# EasyEDA Pro project chaser.eprj

# Schematic Schematic1
Board Name: Board1; Create Date: 2025-12-24; Page Name: P1; Project Name: chaser; Schematic Name: Schematic1; Update Date: 2025-12-25; Company: EasyEDA.com; Page Size: A4; Version: V1.0
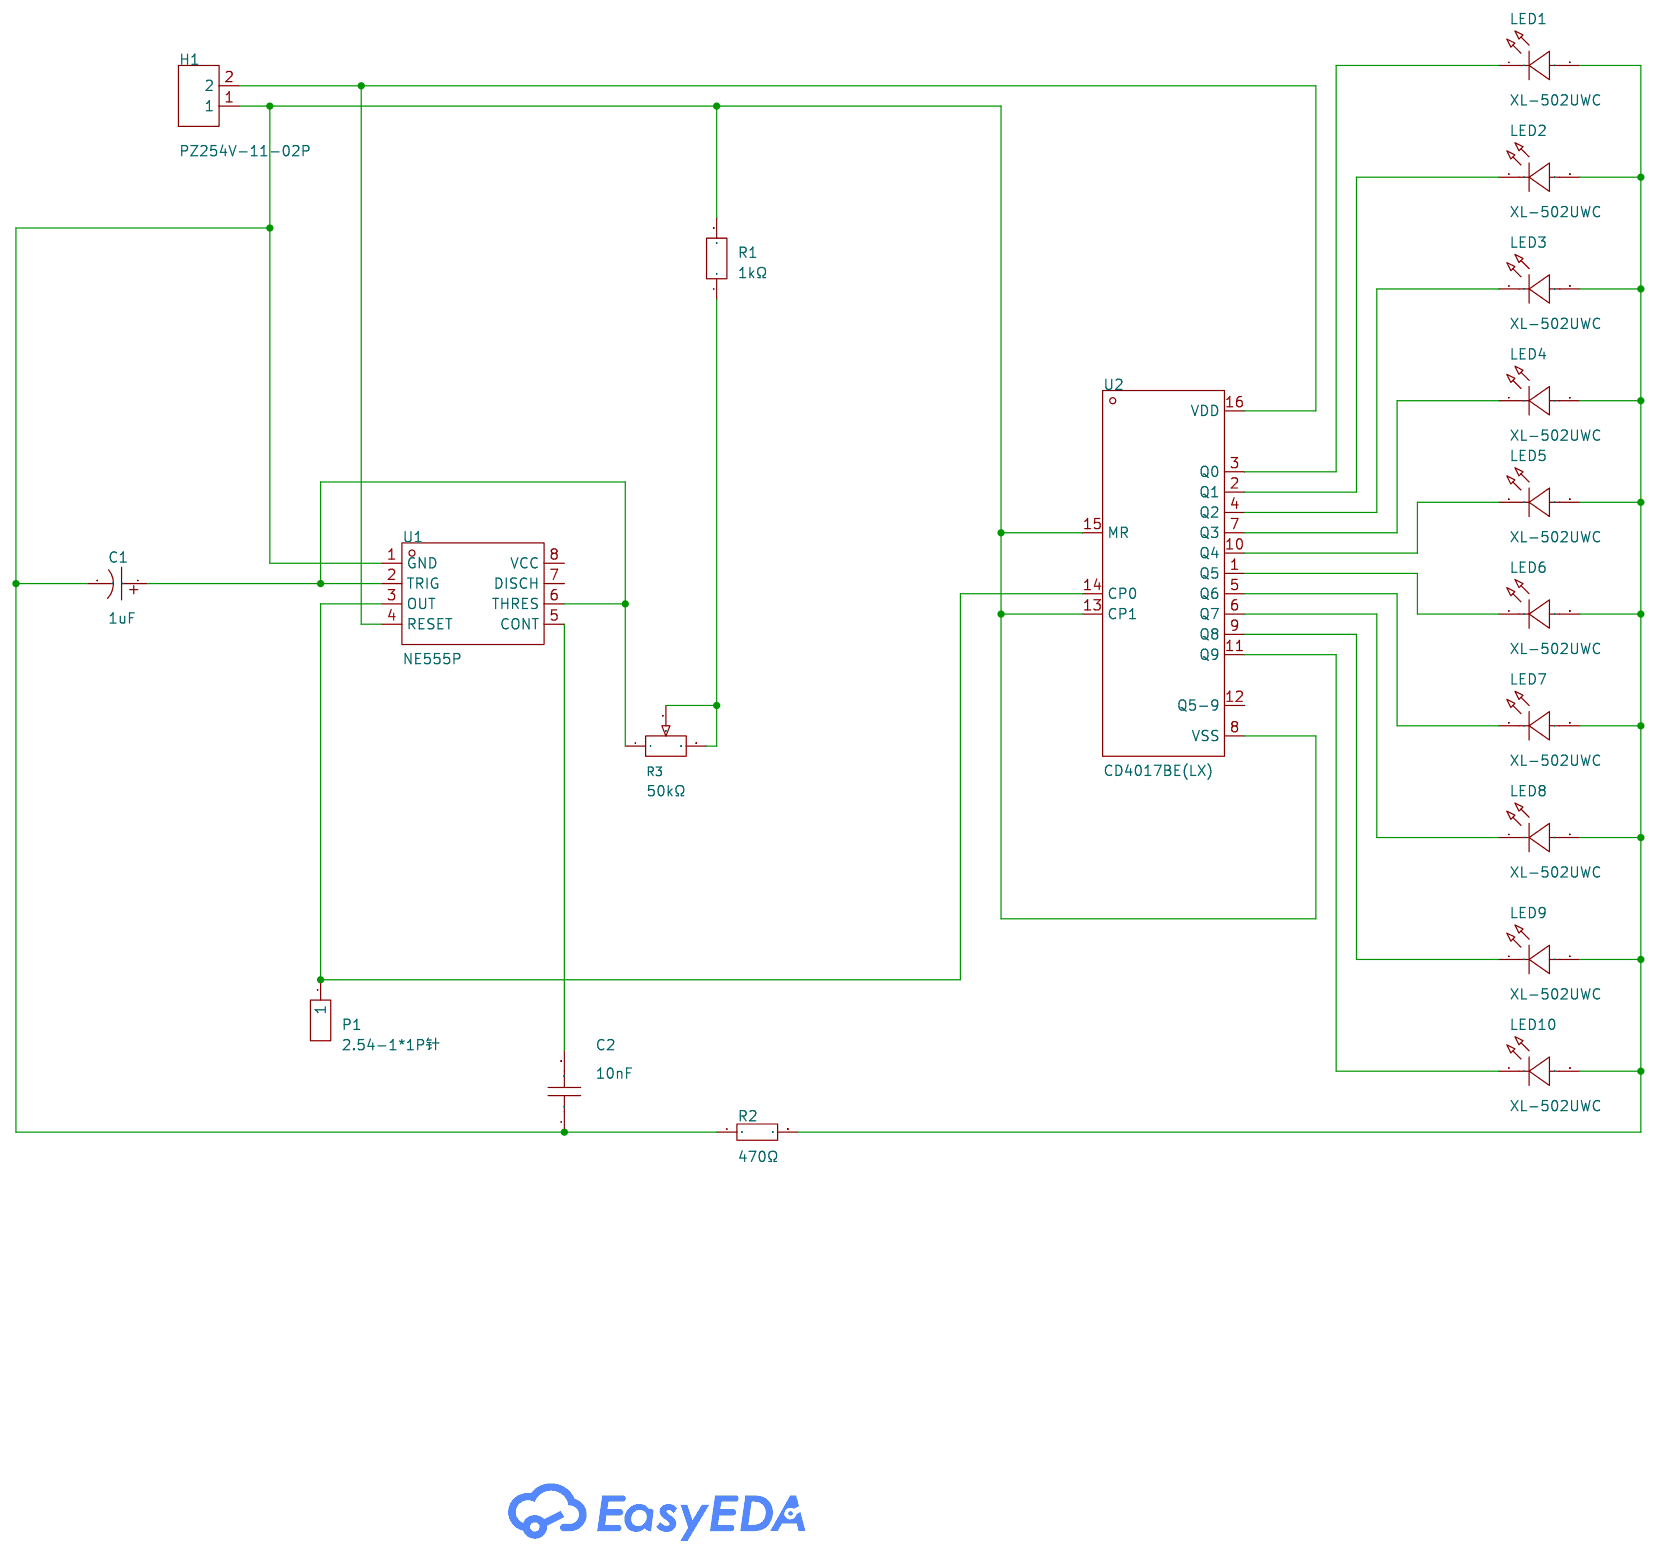
[diagram p0: schematic sheet]

## Parts
C1  1uF  [CAP-TH_BD5.0-P2.00-D0.8-FD]
C2  10nF  [CAP-TH_L8.0-W4.0-P5.00-D1.2]
H1  PZ254V-11-02P  [HDR-TH_2P-P2.54-V-M]
LED1  XL-502UWC  [LED-TH_BD5.9-P2.54-RD_WHITE]
LED2  XL-502UWC  [LED-TH_BD5.9-P2.54-RD_WHITE]
LED3  XL-502UWC  [LED-TH_BD5.9-P2.54-RD_WHITE]
LED4  XL-502UWC  [LED-TH_BD5.9-P2.54-RD_WHITE]
LED5  XL-502UWC  [LED-TH_BD5.9-P2.54-RD_WHITE]
LED6  XL-502UWC  [LED-TH_BD5.9-P2.54-RD_WHITE]
LED7  XL-502UWC  [LED-TH_BD5.9-P2.54-RD_WHITE]
LED8  XL-502UWC  [LED-TH_BD5.9-P2.54-RD_WHITE]
LED9  XL-502UWC  [LED-TH_BD5.9-P2.54-RD_WHITE]
LED10  XL-502UWC  [LED-TH_BD5.9-P2.54-RD_WHITE]
P1  2.54-1*1P针  [HDR-TH_1P-P2.54-V-M]
R1  1kΩ  [RES-TH_BD2.3-L6.5-P10.50-D0.5]
R2  470Ω  [RES-TH_BD2.2-L6.5-P10.50-D0.6]
R3  50kΩ  [RES-ADJ-TH_3P-L9.5-W4.85-P2.50-BL-L]
U1  NE555P  [DIP-8_L9.8-W6.6-P2.54-LS7.6-BL]
U2  CD4017BE(LX)  [PDIP-16_L19.3-W6.4-P2.54-LS7.94-BL]

## Library data of the parts
C1 = KF010M050C110A: Capacitance:1uF Tolerance:±20% Tolerance:±20% Voltage Rating:50V Pin Spacing:2mm Diameter:5mm Height - Seated (Max):11mm Lifetime:2000hrs@105℃; LCSC Part Name: 1uF ±20% 50V; Supplier Part: C62934; Manufacturer: CapXon(丰宾); Supplier Footprint: 插件,D5xL11mm; JLCPCB Part Class: Extended Part; Datasheet: https://item.szlcsc.com/datasheet/KF010M050C110A/63997.html; Supplier: LCSC; Tolerance: ±20%; Voltage Rating: 50V; Pin Spacing: 2mm; Diameter: 5mm; Height - Seated (Max): 11mm; Lifetime: 2000hrs@105℃
C2 = N09F1B103MN0B0S0N0: Capacitance:10nF Tolerance:±20% Tolerance:±20% Voltage Rating:1kV Pin Spacing:5mm Temperature Coefficient:Y5V Diameter:8.5mm Body Thickness:2.5mm; LCSC Part Name: 10nF ±20% 1kV; Supplier Part: C249157; Manufacturer: STE(松田); Supplier Footprint: 插件,P=5mm; JLCPCB Part Class: Extended Part; Datasheet: https://item.szlcsc.com/datasheet/N09F1B103MN0B0S0N0/245516.html; Supplier: LCSC; Tolerance: ±20%; Voltage Rating: 1kV; Pin Spacing: 5mm; Temperature Coefficient: Y5V; Diameter: 8.5mm; Body Thickness: 2.5mm
H1 = PZ254V-11-02P: Pin Structure:1x2P Pitch:2.54mm Row Spacing:- Circluar Pins/Square Pins:Pin Header Mounting Type:Through Hole Number of Rows:1 Number of Pins:2P Current Rating:- Voltage Rating (Max):- Length of Mating Pin:6mm Insulation Height:2.5mm Length of End Connect; LCSC Part Name: 1x2P 间距:2.54mm 方针 直插; Supplier Part: C492401; Manufacturer: XFCN(兴飞); Supplier Footprint: 插件,P=2.54mm; JLCPCB Part Class: Extended Part; Datasheet: https://item.szlcsc.com/datasheet/PZ254V-11-02P/502957.html; Supplier: LCSC; Pin Structure: 1x2P; Pitch: 2.54mm; Circluar Pins/Square Pins: Pin Header; Mounting Type: Through Hole; Number of Rows: 1; Number of Pins: 2P; Length of Mating Pin: 6mm; Insulation Height: 2.5mm; Length of End Connection Pin: 3mm; Contact Material: Brass; Operating Temperature: -40℃~+105℃; Color: Black
LED1-LED10 = XL-502UWC: Lamp Holder Type:5mm Round Lens Illumination Color:White Voltage - Forward(Vf):3.3V Voltage - Forward(Vf):3.3V Power(Watts):70mW Forward Current:20mA Lens Color:Water Clear Color Temperature:9000K~20000K Color Temperature:9000K~20000K Luminous Intensity:2; LCSC Part Name: F5白发白短脚; Supplier Part: C2895480; Manufacturer: XINGLIGHT(成兴光); Supplier Footprint: 插件,D=5mm; JLCPCB Part Class: Extended Part; Datasheet: https://item.szlcsc.com/datasheet/XL-502UWC/3136195.html; Supplier: LCSC; Lamp Holder Type: 5mm Round Lens; Illumination Color: White; Voltage - Forward(Vf): 3.3V; Power(Watts): 70mW; Forward Current: 20mA; Lens Color: Water Clear; Color Temperature: 9000K~20000K; Luminous Intensity: 20000mcd; Viewing Angle: 30°; Operating Temperature: -25℃~+85℃
P1 = 2.54-1*1P针: Pin Structure:- Pitch:- Row Spacing:- Circluar Pins/Square Pins:Pin Header Mounting Type:Through Hole Number of Rows:1 Number of Pins:1P Current Rating:3A Voltage Rating (Max):- Length of Mating Pin:6mm Insulation Height:2.5mm Length of End Connection Pin; LCSC Part Name: 方针 直插; Supplier Part: C81276; Manufacturer: BOOMELE(博穆精密); Supplier Footprint: 插件,P=2.54mm; JLCPCB Part Class: Extended Part; Datasheet: https://item.szlcsc.com/datasheet/2.54-1*1P%25E9%2592%2588/82426.html; Supplier: LCSC; Circluar Pins/Square Pins: Pin Header; Mounting Type: Through Hole; Number of Rows: 1; Number of Pins: 1P; Current Rating: 3A; Length of Mating Pin: 6mm; Insulation Height: 2.5mm; Length of End Connection Pin: 3mm; Contact Material: Brass; Contact Plating: Gold; Operating Temperature: -55℃~+105℃; Color: Black
R1 = MF1/4W-1KΩ±1%T52: Type:Metal Film Resistors Resistance: Tolerance:±1% Tolerance:±1% Power(Watts):250mW Temperature Coefficient:±200ppm/℃ Temperature Coefficient:±200ppm/℃; LCSC Part Name: 金属膜电阻 1kΩ ±1% 250mW; Supplier Part: C713997; Manufacturer: 华星机电; Supplier Footprint: 插件,D2.3xL6.5mm; JLCPCB Part Class: Extended Part; Datasheet: https://atta.szlcsc.com/upload/public/pdf/source/20200731/C713882_AE8EB1102749D7E4FB4FB13DC898C429.pdf; Supplier: LCSC; Type: Metal Film Resistors; Tolerance: ±1%; Power(Watts): 250mW; Temperature Coefficient: ±200ppm/℃
R2 = MFR0W4F4700A50: Type:Metal Film Resistors Resistance: Tolerance:±1% Tolerance:±1% Voltage-Supply(Max):250V Power(Watts):250mW Temperature Coefficient:±50ppm/℃ Temperature Coefficient:±50ppm/℃; LCSC Part Name: 470Ω ±1% 250mW 金属膜电阻 铜脚，圆柱状直插; Supplier Part: C58592; Manufacturer: UNI-ROYAL(厚声); Supplier Footprint: 插件,D2.2xL6.5mm; JLCPCB Part Class: Extended Part; Datasheet: https://atta.szlcsc.com/upload/public/pdf/source/20191012/C436293_8820AA14BC71FA35E551C06C441482A0.pdf; Supplier: LCSC; Type: Metal Film Resistors; Tolerance: ±1%; Voltage-Supply(Max): 250V; Power(Watts): 250mW; Temperature Coefficient: ±50ppm/℃
R3 = 3296X-1-503_C118912: Resistance:50kΩ Tolerance:±10% Tolerance:±10% Power(Watts):500mW Temperature Coefficient:±250ppm/℃ Temperature Coefficient:±250ppm/℃ Number of Turns:30; LCSC Part Name: 50kΩ ±10%; Supplier Part: C118912; Manufacturer: BOCHEN(博晨); Manufacturer Part: 3296X-1-503; Supplier Footprint: 插件-3P,9.5x4.9mm; JLCPCB Part Class: Extended Part; Datasheet: https://item.szlcsc.com/datasheet/3296X-1-503/120181.html; Supplier: LCSC; Tolerance: ±10%; Power(Watts): 500mW; Temperature Coefficient: ±250ppm/℃; Number of Turns: 30
U1 = NE555P: Supplier Part: C46749; Manufacturer: TI(德州仪器); Supplier Footprint: DIP-8; JLCPCB Part Class: Extended Part; Datasheet: https://www.ti.com/cn/lit/gpn/ne555; Supplier: LCSC
U2 = CD4017BE(LX): Logic Type:Divide-by-10 Direction:Up Counter Voltage - Supply:3V~15V Voltage - Supply:3V~15V Number of Elements:1 Trigger Type:Rising Edge Reset:Asynchronous Count Rate:11MHz Operating Temperature:-40℃~+85℃ Operating Temperature:-40℃~+85℃; Supplier Part: C32710674; Manufacturer: LX(灵星芯微); Supplier Footprint: DIP-16; JLCPCB Part Class: Extended Part; Datasheet: https://atta.szlcsc.com/upload/public/pdf/source/20240723/A05E41C3796D239DF5E274CF6ACDBDA1.pdf; Supplier: LCSC; Logic Type: Divide-by-10; Direction: Up Counter; Voltage - Supply: 3V~15V; Number of Elements: 1; Trigger Type: Rising Edge; Reset: Asynchronous; Count Rate: 11MHz; Operating Temperature: -40℃~+85℃

## Nets
$1N1390: LED1.2(A) LED2.2(A) LED3.2(A) LED4.2(A) LED5.2(A) LED6.2(A) LED7.2(A) LED8.2(A) LED9.2(A) LED10.2(A) R2.2
$1N1559: LED1.1(K) U2.3(Q0)
$1N1565: LED2.1(K) U2.2(Q1)
$1N1575: LED3.1(K) U2.4(Q2)
$1N1582: LED4.1(K) U2.7(Q3)
$1N1598: LED5.1(K) U2.10(Q4)
$1N1604: LED6.1(K) U2.1(Q5)
$1N1611: LED7.1(K) U2.5(Q6)
$1N1618: LED8.1(K) U2.6(Q7)
$1N1633: LED9.1(K) U2.9(Q8)
$1N1652: H1.2 U1.4(RESET) U2.16(VDD)
$1N1677: LED10.1(K) U2.11(Q9)
$1N1693: C1.2 C2.1 H1.1 R1.2 R2.1 U1.1(GND) U2.8(VSS) U2.13(CP1) U2.15(MR)
$1N1767: P1.1 U1.3(OUT) U2.14(CP0)
$1N1788: C1.1 R3.1 U1.2(TRIG) U1.6(THRES)
$1N1812: R1.1 R3.2 R3.3
$1N1916: C2.2 U1.5(CONT)

Not connected (* = marked no-connect by the designer): U1 7(DISCH) 8(VCC); U2 12(Q5-9)

# Board PCB1
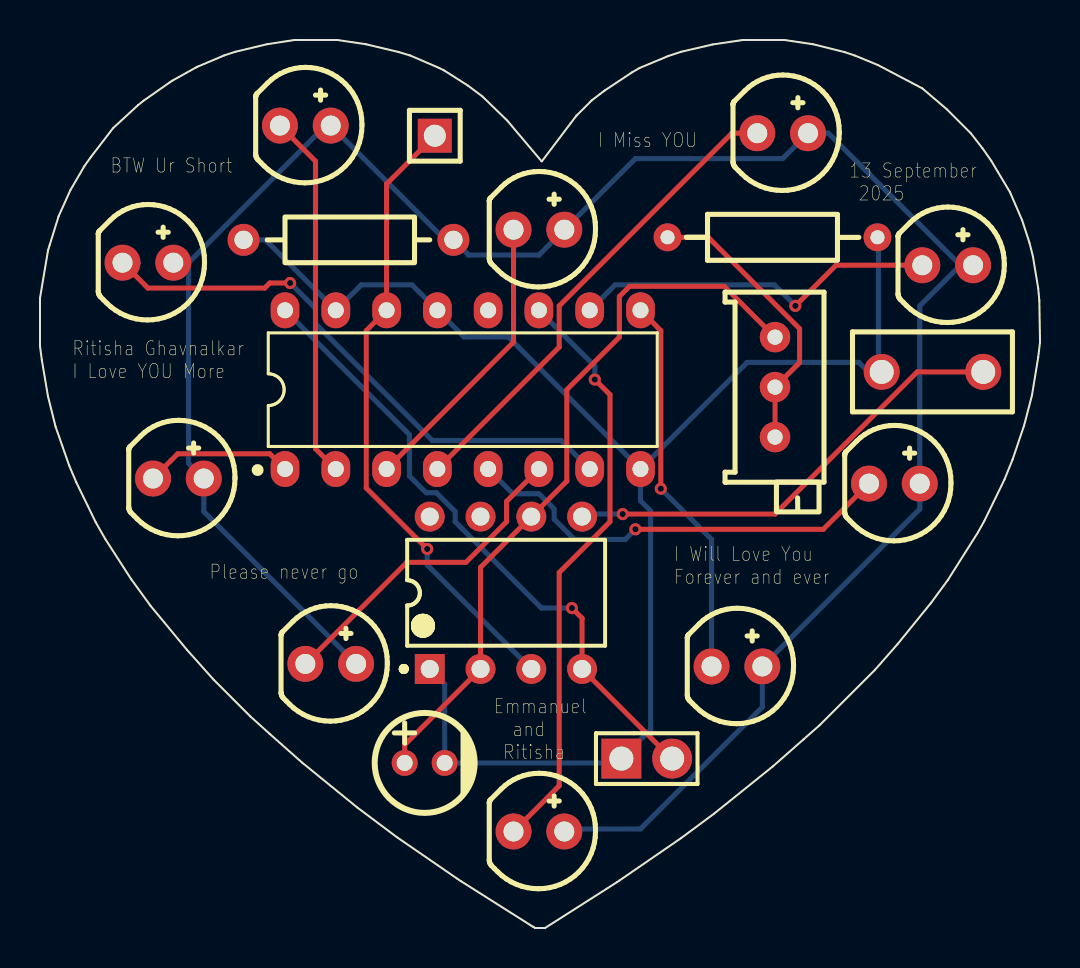
[diagram p1: board, top side]
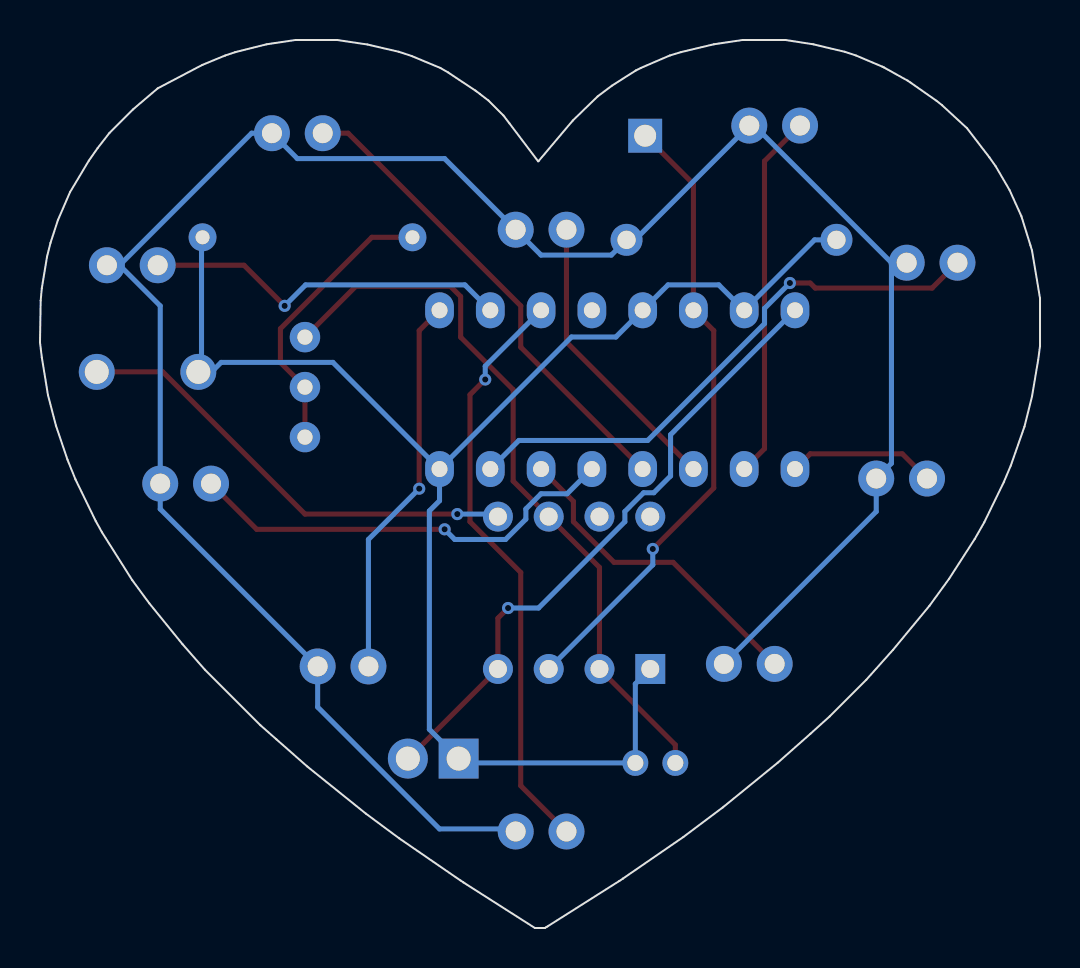
[diagram p2: board, bottom side, seen from below]

Outline 50.02 x 44.42 mm; copper layers: Top Layer, Bottom Layer. Coordinates in mm from the lower left corner of the outline.
Outline path: 0,31.5 0,29.11 0.09,28.42 0.4,26.59 0.78,25.08 1.46,23.13 1.81,22.3 2.79,20.3 3.26,19.46 4.55,17.46 5.53,16.12 7.36,13.91 8.69,12.41 10.52,10.58 11.48,9.72 13.12,8.27 15.86,6.03 17.84,4.55 20.86,2.47 21.05,2.35 24.64,0.08 24.69,0.05 24.76,0 25.26,0 28.84,2.28 28.99,2.38 32.06,4.49 33.72,5.72 36.65,8.08 38.19,9.43 39,10.14 41.77,12.92 42.89,14.19 44.56,16.24 45.41,17.4 46.92,19.79 47.24,20.36 48.25,22.43 48.65,23.43 49.22,25.13 49.62,26.65 49.93,28.54 50.02,29.3 49.99,31.38 49.93,32 49.67,33.58 49.5,34.27 49.13,35.4 48.52,36.8 47.58,38.38 47.14,39.01 46.56,39.75 45.36,40.95 44.13,41.99 41.9,43.17 40.75,43.64 40.26,43.8 38.68,44.2 37.23,44.42 35.15,44.42 33.64,44.19 32.07,43.83 31.43,43.61 29.99,43.02 29.6,42.79 28.24,41.88 28.02,41.72 27.59,41.39 26.84,40.64 26.54,40.24 25.11,38.35 25.08,38.36 23.37,40.38 22.12,41.59 21.41,42.13 20.22,42.89 19.96,43.02 18.52,43.64 17.96,43.81 16.31,44.2 14.87,44.42 12.73,44.42 11.34,44.2 9.77,43.83 9.2,43.64 7.88,43.08 7.81,43.04 6.62,42.38 6.48,42.29 5.18,41.38 4.9,41.15 3.65,40 2.53,38.55 2.22,38.1 1.52,36.91 0.93,35.6 0.48,34.15 0.4,33.89 0,31.5
Stack: Top Layer 0.035mm / Dielectric1 1.51mm FR4 er 4.5 / Bottom Layer 0.035mm

## Design rules (mm)
template: JLCPCB Capability(Two Layers Board)
spacing copperThickness1oz (default): track to track 0.102, other pairs 0.152 to 0.3
spacing copperThickness2oz: track to track 0.203, other pairs 0.152 to 0.3
track width copperThickness1oz (default): min 0.127, default 0.254, max 2.54
track width copperThickness2oz: min 0.203, default 0.254, max 2.54
differential pair differentialPair (default): width min 0.127, default 0.254, max 2.54; gap min 0.152, default 0.152
via viaSize (default): diameter min 0.5, default 0.61, max 10; hole min 0.3, default 0.305, max 6.3

## Placement (name value [footprint] x y rotation side)
C1  1uF  [CAP-TH_BD5.0-P2.00-D0.8-FD]  19.24 8.26 0 top
C2  10nF  [CAP-TH_L8.0-W4.0-P5.00-D1.2]  44.64 27.81 0 top
H1  PZ254V-11-02P  [HDR-TH_2P-P2.54-V-M]  30.35 8.47 0 top
LED1  XL-502UWC  [LED-TH_BD5.9-P2.54-RD_WHITE]  24.96 34.93 0 top
LED2  XL-502UWC  [LED-TH_BD5.9-P2.54-RD_WHITE]  13.27 40.13 0 top
LED3  XL-502UWC  [LED-TH_BD5.9-P2.54-RD_WHITE]  37.15 39.75 0 top
LED4  XL-502UWC  [LED-TH_BD5.9-P2.54-RD_WHITE]  5.4 33.28 0 top
LED5  XL-502UWC  [LED-TH_BD5.9-P2.54-RD_WHITE]  45.4 33.15 0 top
LED6  XL-502UWC  [LED-TH_BD5.9-P2.54-RD_WHITE]  6.92 22.48 0 top
LED7  XL-502UWC  [LED-TH_BD5.9-P2.54-RD_WHITE]  42.74 22.23 0 top
LED8  XL-502UWC  [LED-TH_BD5.9-P2.54-RD_WHITE]  14.54 13.21 0 top
LED9  XL-502UWC  [LED-TH_BD5.9-P2.54-RD_WHITE]  34.86 13.08 0 top
LED10  XL-502UWC  [LED-TH_BD5.9-P2.54-RD_WHITE]  24.96 4.83 0 top
P1  2.54-1*1P针  [HDR-TH_1P-P2.54-V-M]  19.75 39.63 0 top
R1  1kΩ  [RES-TH_BD2.3-L6.5-P10.50-D0.5]  36.64 34.55 0 top
R2  470Ω  [RES-TH_BD2.2-L6.5-P10.50-D0.6]  15.43 34.42 0 top
R3  50kΩ  [RES-ADJ-TH_3P-L9.5-W4.85-P2.50-BL-L]  36.77 27.05 0 top
U1  NE555P  [DIP-8_L9.8-W6.6-P2.54-LS7.6-BL]  23.31 16.77 0 top
U2  CD4017BE(LX)  [PDIP-16_L19.3-W6.4-P2.54-LS7.94-BL]  21.15 26.93 0 top

## Footprints (pads in the part's own frame, mm; a bottom-side part is the same pattern mirrored in y, then rotated)
CAP-TH_BD5.0-P2.00-D0.8-FD
  round 1.3 hole 0.8: 1(-1,0) 2(1,0)
CAP-TH_L8.0-W4.0-P5.00-D1.2
  round 1.8 hole 1.2: 1(-2.54,0) 2(2.54,0)
DIP-8_L9.8-W6.6-P2.54-LS7.6-BL
  rect 1.5x1.5 hole 0.9: 1(-3.81,-3.81)
  round 1.5 hole 0.9: 2(-1.27,-3.81) 3(1.27,-3.81) 4(3.81,-3.81) 5(3.81,3.81) 6(1.27,3.81) 7(-1.27,3.81) 8(-3.81,3.81)
HDR-TH_1P-P2.54-V-M
  rect 1.7x1.7 hole 1.1: 1(0,0)
HDR-TH_2P-P2.54-V-M
  rect 2x2 hole 1.2: 1(-1.27,0)
  round 2 hole 1.2: 2(1.27,0)
LED-TH_BD5.9-P2.54-RD_WHITE
  round 1.8 hole 1: 1(-1.27,0) 2(1.27,0)
PDIP-16_L19.3-W6.4-P2.54-LS7.94-BL
  oval 1.44x1.8 hole 0.8: 1(-8.89,-3.97) 2(-6.35,-3.97) 3(-3.81,-3.97) 4(-1.27,-3.97) 5(1.27,-3.97) 6(3.81,-3.97) 7(6.35,-3.97) 8(8.89,-3.97) 9(8.89,3.97) 10(6.35,3.97) 11(3.81,3.97) 12(1.27,3.97) 13(-1.27,3.97) 14(-3.81,3.97) 15(-6.35,3.97) 16(-8.89,3.97)
RES-ADJ-TH_3P-L9.5-W4.85-P2.50-BL-L
  round 1.524 hole 0.762: 1(0,2.5) 2(0,0) 3(0,-2.5)
RES-TH_BD2.2-L6.5-P10.50-D0.6
  round 1.6 hole 0.914: 1(-5.25,0) 2(5.25,0)
RES-TH_BD2.3-L6.5-P10.50-D0.5
  round 1.4 hole 0.7: 1(-5.25,0) 2(5.25,0)

## Nets
As in the schematic.

Pads without a net: U1 7 8; U2 12

## Via types
v1: diameter 0.61, hole 0.305, Top Layer to Bottom Layer, 8 vias

## Routing (per net, layer and track width the routed paths; a pad name or vN(x,y) marks a point on that pad's centre or on a via; arc(x,y) is an arc through that point)
$1N1390: length 113
  Bottom Layer w0.254: LED8.2 8.19,20.83 LED6.2 7.43,23.24 7.43,33.28 ; 46.04,33.15 LED5.2 ; 46.04,33.15 39.44,39.75 LED3.2 37.15,38.48 29.78,38.48 LED1.2 24.96,33.66 21.44,33.66 R2.2 20.26,34.42 LED2.2 14.29,40.13 7.43,33.28 ; 46.04,33.15 44.01,31.12 LED7.2 44.01,20.96 LED9.2 36.13,11.05 30.04,4.95 26.35,4.95 LED10.2 ; 7.43,33.28 LED4.2
$1N1559: length 14.6
  Top Layer w0.254: U2.3 23.69,29.31 LED1.1
$1N1565: length 18.3
  Top Layer w0.254: LED2.1 13.78,38.36 13.78,23.97 U2.2
$1N1575: length 24.2
  Top Layer w0.254: LED3.1 34.61,39.75 25.97,31.12 25.97,29.05 U2.4
$1N1582: length 28.3
  Top Layer w0.254: v1(12.51,32.26) 11.5,32.26 11.24,32.01 5.4,32.01 LED4.1
  Bottom Layer w0.254: v1(12.51,32.26) 13.78,30.99 13.78,30.23 19.62,24.39 26.07,24.39 U2.7
$1N1598: length 18.4
  Top Layer w0.254: LED5.1 39.82,33.15 v1(37.78,31.12)
  Bottom Layer w0.254: v1(37.78,31.12) 36.73,32.17 28.77,32.17 U2.10
$1N1604: length 7.4
  Top Layer w0.254: LED6.1 6.89,23.72 11.5,23.72 U2.1
$1N1611: length 22
  Top Layer w0.254: v1(29.78,19.94) 39.18,19.94 LED7.1
  Bottom Layer w0.254: U2.5 23.65,21.72 24.96,21.72 25.72,20.96 25.72,20.45 26.73,19.43 29.28,19.43 v1(29.78,19.94)
$1N1618: length 16.3
  Top Layer w0.254: LED8.1 18.35,18.29 21.31,18.29 23.34,20.32 23.34,21.34 U2.6
$1N1633: length 19.3
  Top Layer w0.254: U2.9 31.05,29.88 v1(31.05,21.97)
  Bottom Layer w0.254: LED9.1 33.59,19.43 v1(31.05,21.97)
$1N1652: length 31.6
  Top Layer w0.254: H1.2 31.6,8.47 U1.4 27.12,15.5 v1(26.61,16)
  Bottom Layer w0.254: v1(26.61,16) 25.08,16 20.77,20.32 20.77,20.83 19.83,21.77 19.32,21.77 18.48,22.61 18.48,24.67 U2.16
$1N1677: length 29.5
  Top Layer w0.254: v1(27.75,27.43) 28.51,26.67 28.51,20.32 25.97,17.78 25.97,7.11 LED10.1
  Bottom Layer w0.254: U2.11 27.75,28.1 v1(27.75,27.43)
$1N1693: length 76.1
  Bottom Layer w0.254: 41.94,27.81 41.43,27.81 40.96,28.29 35.37,28.29 U2.8 ; 41.94,27.81 C2.1 ; 41.94,27.81 41.94,34.5 R1.2 ; U2.8 30.04,21.37 30.54,20.86 30.54,9.94 H1.1 28.86,8.26 C1.2 20.24,12.21 U1.1 ; U2.8 23.43,29.56 21.21,29.56 U2.13 18.61,32.17 16.07,32.17 U2.15 11.27,34.42 R2.1
$1N1767: length 31.5
  Top Layer w0.254: v1(19.37,18.96) 16.32,22.01 16.32,29.88 U2.14 17.34,37.21 P1.1
  Bottom Layer w0.254: U1.3 19.37,18.16 v1(19.37,18.96)
$1N1788: length 36.8
  Top Layer w0.254: R3.1 34.23,32.09 29.49,32.09 28.98,31.58 28.98,29.55 26.35,26.93 26.35,22.35 U1.6 22.04,18.04 22.04,12.96 18.24,9.16 C1.1
$1N1812: length 14.4
  Top Layer w0.254: R1.1 33.42,34.55 38,29.97 38,28.28 R3.2 R3.3
$1N1916: length 23.1
  Top Layer w0.254: C2.2 43.88,27.81 36.77,20.7 v1(29.15,20.7)
  Bottom Layer w0.254: U1.5 27.24,20.7 v1(29.15,20.7)

## Text on the board
Top Silkscreen Layer: Ritisha Ghavnalkar / I Love YOU More | BTW Ur Short | Please never go | Emmanuel / and / Ritisha | I Miss YOU | I Will Love You / Forever and ever | 13 September / 2025
